# EAGLE design mainboard.v3 (EAGLE 6.4)
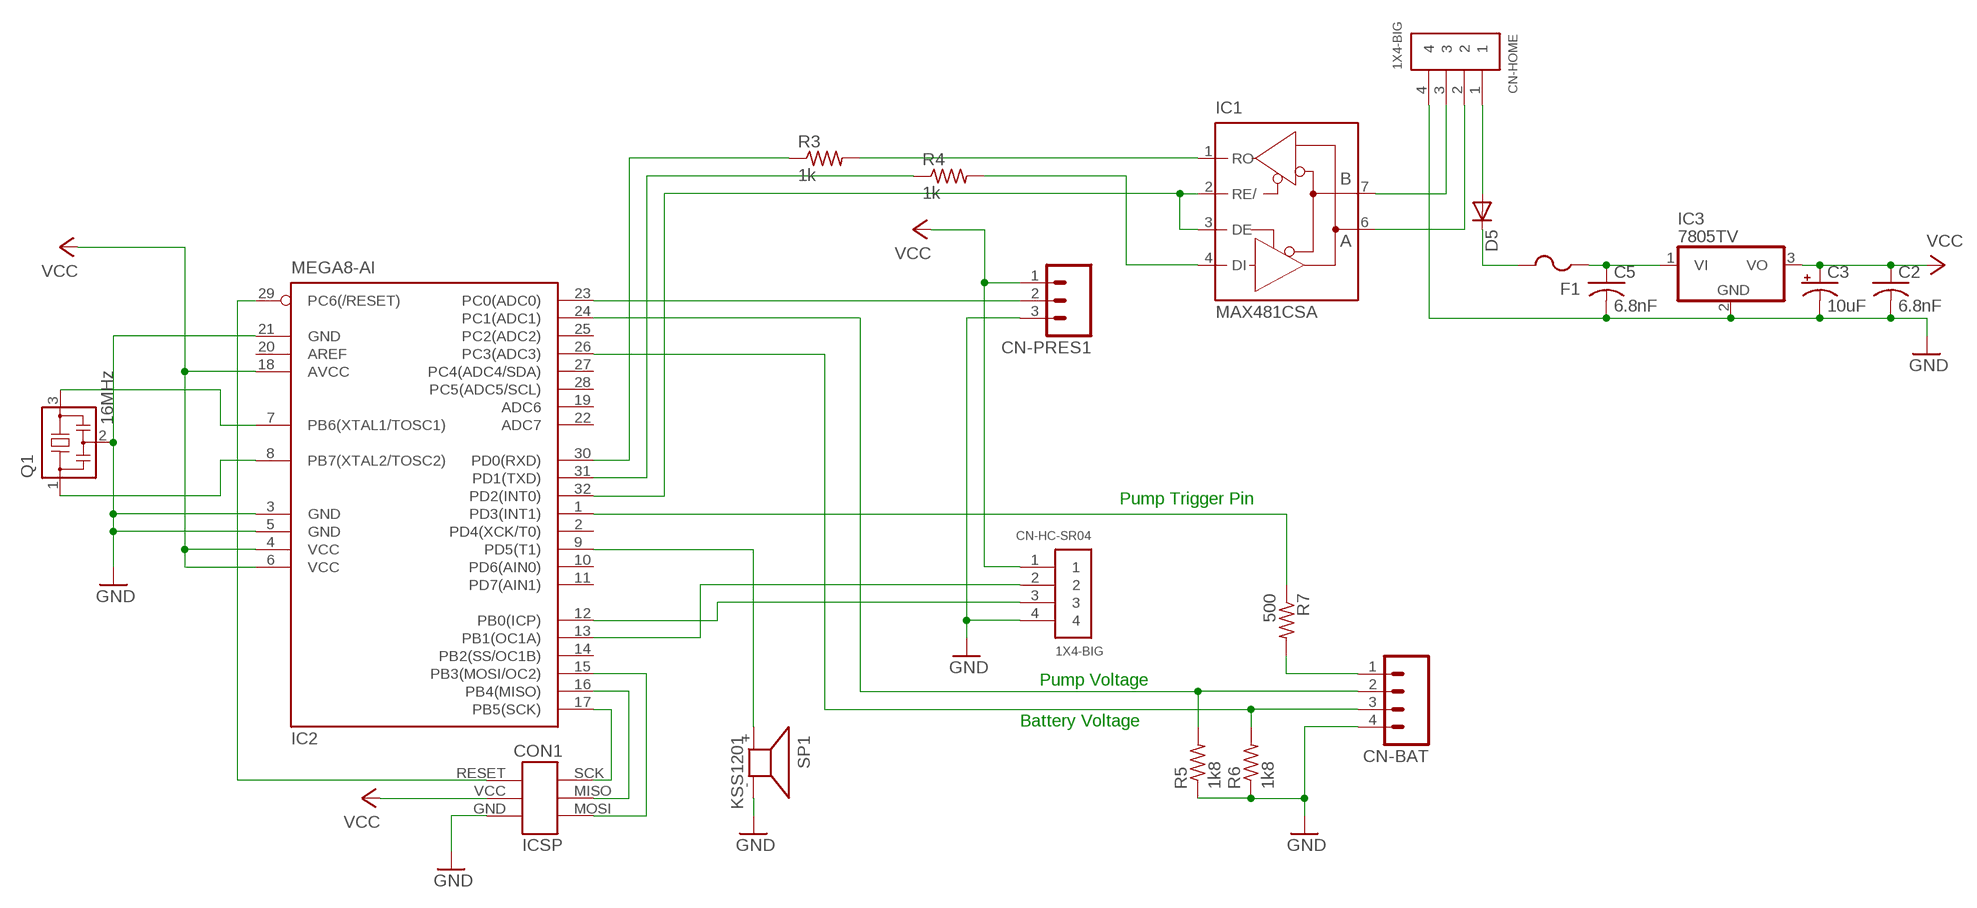
[diagram p0: schematic, sheet 1]

## Parts
C2  6.8nF  C-US050-024X044  [C050-024X044]
C3  10uF  CPOL-USE1.8-4  [E1,8-4]
C5  6.8nF  C-US050-024X044  [C050-024X044]
CN-BAT  M04  [04P]
CN-HC-SR04  1X4-BIG  [1X04-BIG]
CN-HOME  1X4-BIG  [1X04-BIG]
CN-PRES1  M03  [03P]
CON1  ICSP-HEADER  [ICSP-HEADER]
D5  DIODE-MICROMELF-W  [MICROMELF-W]
F1  PTCFUSE-1206  [R1206]
IC1  MAX481CSA  [SO08]
IC2  MEGA8-AI  [TQFP32-08]
IC3  7805TV  [TO220V]
Q1  16MHz  RESONATOR  [RESONATOR]
R3  1k  R-US_R0603  [R0603]
R4  1k  R-US_R0603  [R0603]
R5  1k8  R-US_R0603  [R0603]
R6  1k8  R-US_R0603  [R0603]
R7  500  R-US_R0603  [R0603]
SP1  KSS1201  [KSS1201]

## Nets
GND: C2.2 C3.- C5.2 CN-BAT.4 CN-HC-SR04.4 CN-HOME.4 CN-PRES1.3 CON1.GND IC2.3(GND) IC2.5(GND) IC2.21(GND) IC3.2(GND) Q1.2 R5.1 R6.1 SP1.-
N$1: IC2.7(PB6(XTAL1/TOSC1)) Q1.3
N$2: IC2.8(PB7(XTAL2/TOSC2)) Q1.1
N$3: CON1.SCK IC2.17(PB5(SCK))
N$4: CON1.MISO IC2.16(PB4(MISO))
N$5: CON1.MOSI IC2.15(PB3(MOSI/OC2))
N$6: CON1.RESET IC2.29(PC6(/RESET))
N$8: C5.1 F1.1 IC3.1(VI)
N$9: CN-HOME.1 D5.A
N$10: D5.C F1.2
N$11: IC2.1(PD3(INT1)) R7.1
N$13: IC2.9(PD5(T1)) SP1.+
N$14: IC1.1(RO) R3.2
N$15: IC1.4(DI) R4.2
N$16: CN-BAT.1 R7.2
N$17: CN-PRES1.2 IC2.23(PC0(ADC0))
N$18: CN-HC-SR04.2 IC2.13(PB1(OC1A))
N$19: CN-HC-SR04.3 IC2.12(PB0(ICP))
N$20: CN-HOME.3 IC1.7(B)
N$21: CN-BAT.3 IC2.26(PC3(ADC3)) R6.2
N$22: IC1.2(RE/) IC1.3(DE) IC2.32(PD2(INT0))
N$23: IC2.30(PD0(RXD)) R3.1
N$24: IC2.31(PD1(TXD)) R4.1
N$25: CN-BAT.2 IC2.24(PC1(ADC1)) R5.2
N$26: CN-HOME.2 IC1.6(A)
VCC: C2.1 C3.+ CN-HC-SR04.1 CN-PRES1.1 CON1.VCC(+5V) IC2.4(VCC) IC2.6(VCC) IC2.18(AVCC) IC3.3(VO)
Unconnected: IC2.2(PD4(XCK/T0)) IC2.10(PD6(AIN0)) IC2.11(PD7(AIN1)) IC2.14(PB2(SS/OC1B)) IC2.19(ADC6) IC2.20(AREF) IC2.22(ADC7) IC2.25(PC2(ADC2)) IC2.27(PC4(ADC4/SDA)) IC2.28(PC5(ADC5/SCL))

## Notes on the sheet
- Pump Trigger Pin
- Pump Voltage
- Battery Voltage

## Power pins joined to a net without a drawn wire
GND: IC1.5(GND)
VCC: IC1.8(VCC)

## Library data of the parts
C2 C5 = adafruit:C-US: CAPACITOR, American symbol
C3 = adafruit:CPOL-US: POLARIZED CAPACITOR, American symbol
CN-BAT = con-amp-quick:M04: AMP QUICK CONNECTOR; OC_FARNELL: unknown; OC_NEWARK: unknown
CN-HC-SR04 CN-HOME = adafruit:1X4: 4-pin connector
CN-PRES1 = con-amp-quick:M03: AMP QUICK CONNECTOR; OC_FARNELL: unknown; OC_NEWARK: unknown
CON1 = serge:ICSP-HEADER
D5 = diode:DIODE-: DIODE
F1 = adafruit:PTCFUSE: PTC fuses, resettable thermistors
IC1 = maxim:MAX481CSA: RS485 TRANSEIVER; MF: MAXIM; MPN: MAX481CSA; OC_FARNELL: unknown; OC_NEWARK: 90C3817
IC2 = atmel:MEGA8: MICROCONTROLLER 8 Kbytes FLASH, 1 kbytes SRAM, 512 bytes EEPROM, USART, 6-channel 10 bit ADC, 2-channel 8 bit ADC Pin compatible with Atmega48, ATMega88, ATMega168 Source: avr.lbr; MPN: ATMEGA8-16AU; OC_FARNELL: 9171371; OC_NEWARK: 73M8863
IC3 = linear:78*: Positive VOLTAGE REGULATOR Source: http://cache.national.com/ds/LM/LM78L05.pdf http://www.fairchildsemi.com/ds/LM/LM7805.pdf
Q1 = serge:RESONATOR
R3-R7 = adafruit:R-US_: RESISTOR, American symbol
SP1 = buzzer:KSS1201: SPEAKER Source: Schukat; OC_FARNELL: unknown; OC_NEWARK: unknown

## Board
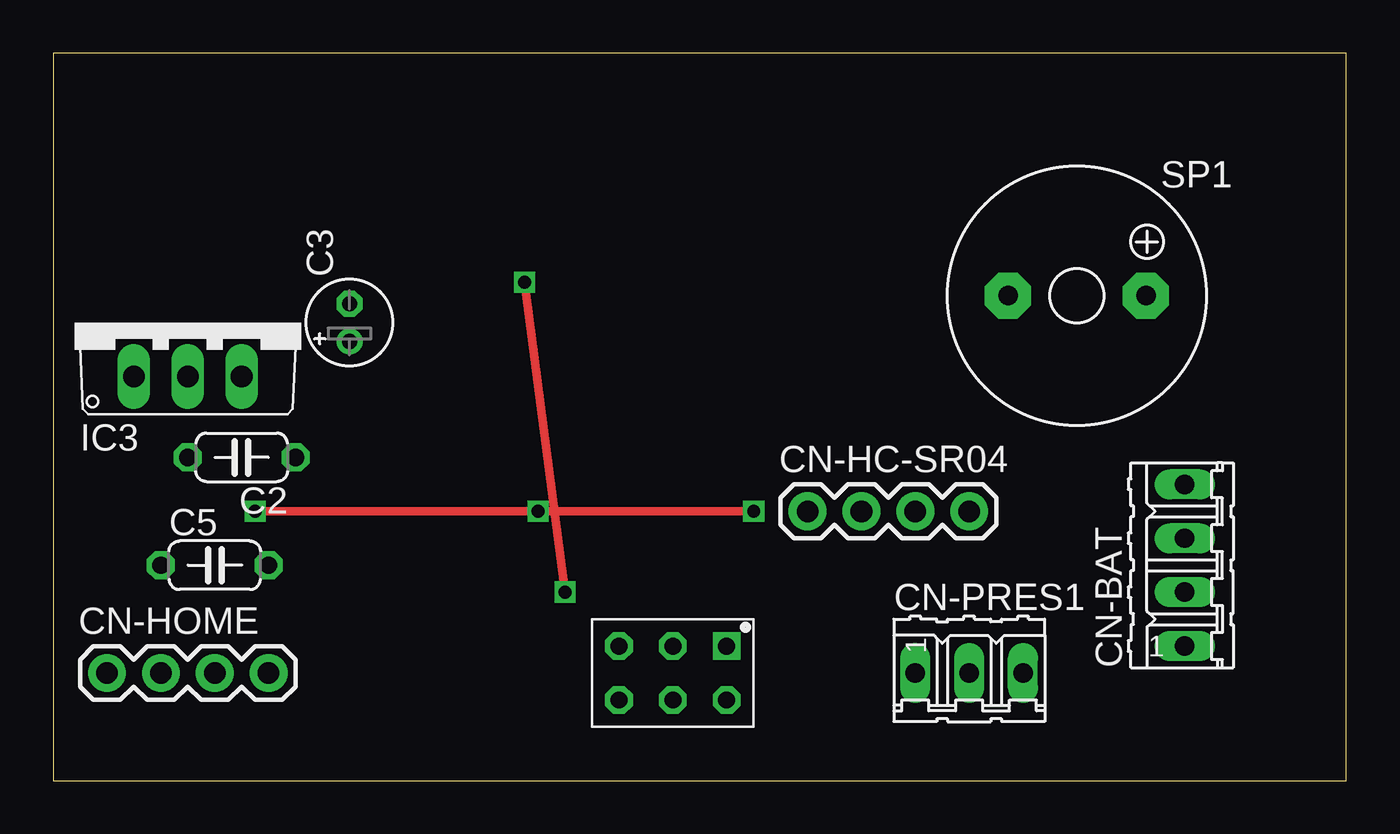
[diagram p1: board, top side]
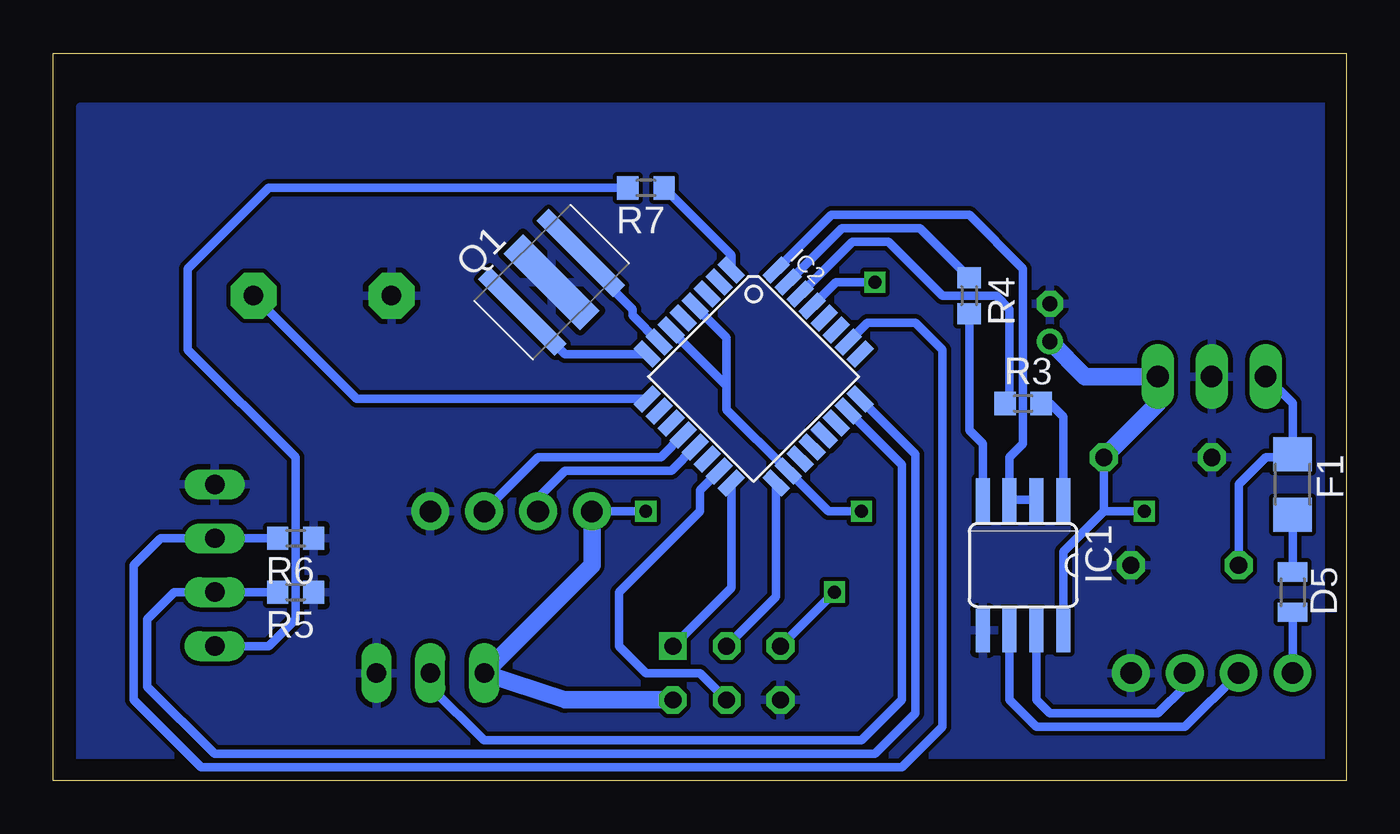
[diagram p2: board, bottom side, seen from below]

Size 60.96 x 34.29 mm. Coordinates in mm from the lower left corner, seen from the top.
Outline: 0,0 60.96,0 60.96,34.29 0,34.29 0,0
Copper layers (1*16): Top 0.035mm / dielectric 1.5mm / Bottom 0.035mm
Design rules "default": minimum track width 10mil, minimum drill 24mil, track to track 8mil, track to pad 8mil, pad to pad 8mil, via to via 8mil, smd to smd 8mil, copper to edge 40mil, drill to drill 8mil, minimum pad ring 10mil, minimum via ring 8mil, stop-mask expansion 4mil, vias tented up to drill 0mil, thermal gap 10mil

### Footprints (pad centres in the part's own frame; a part is rotated, then mirrored left to right if it is on the bottom)
C050-024X044 = drill 0.813 octagon: 1 -2.54,0; 2 2.54,0
E1,8-4 = drill 0.711 pad 1.168: + -0.889,0 | drill 0.711 pad 1.168 octagon: - 0.889,0
04P = drill 0.914 long: 1 -3.81,0; 2 -1.27,0; 3 1.27,0; 4 3.81,0
1X04-BIG = drill 1.016 pad 1.778: 1 0,0; 2 2.54,0; 3 5.08,0; 4 7.62,0
03P = drill 0.914 long: 1 -2.54,0; 2 0,0; 3 2.54,0
ICSP-HEADER = drill 0.8 octagon: GND 1.27,-3.81; MOSI 1.27,-1.27; RESET -1.27,-3.81; SCK -1.27,-1.27; VCC 1.27,1.27 | drill 0.8 square: MISO -1.27,1.27
MICROMELF-W = smd 0.9 x 1.4: A 0.95,0; C -0.95,0
R1206 = smd 1.6 x 1.803: 1 -1.422,0; 2 1.422,0
SO08 = smd 0.66 x 2.032: 1 -1.905,-3.073; 2 -0.635,-3.073; 3 0.635,-3.073; 4 1.905,-3.073; 5 1.905,3.073; 6 0.635,3.073; 7 -0.635,3.073; 8 -1.905,3.073
TQFP32-08 = smd 1.27 x 0.559: 1 -4.293,2.8; 2 -4.293,2; 3 -4.293,1.2; 4 -4.293,0.4; 5 -4.293,-0.4; 6 -4.293,-1.2; 7 -4.293,-2; 8 -4.293,-2.8; 17 4.293,-2.8; 18 4.293,-2; 19 4.293,-1.2; 20 4.293,-0.4; 21 4.293,0.4; 22 4.293,1.2; 23 4.293,2; 24 4.293,2.8 | smd 0.559 x 1.27: 9 -2.8,-4.293; 10 -2,-4.293; 11 -1.2,-4.293; 12 -0.4,-4.293; 13 0.4,-4.293; 14 1.2,-4.293; 15 2,-4.293; 16 2.8,-4.293; 25 2.8,4.293; 26 2,4.293; 27 1.2,4.293; 28 0.4,4.293; 29 -0.4,4.293; 30 -1.2,4.293; 31 -2,4.293; 32 -2.8,4.293
TO220V = drill 1.016 long: 1 -2.54,-2.54; 2 0,-2.54; 3 2.54,-2.54
RESONATOR = smd 0.8 x 5.1: 1 -1.95,0; 3 1.95,0 | smd 1.3 x 5.1: 2 0,0
R0603 = smd 1 x 1.1: 1 -0.85,0; 2 0.85,0
KSS1201 = drill 0.914 pad 2.159 octagon: + 3.251,0; - -3.251,0

### Placement (x,y rotation side)
C2  8.89,15.24 180 top
C3  13.97,21.59 90 top
C5  7.62,10.16 0 top
CN-BAT  53.34,10.16 90 top
CN-HC-SR04  35.56,12.7 0 top
CN-HOME  2.54,5.08 0 top
CN-PRES1  43.18,5.08 0 top
CON1  30.48,5.08 270 top
D5  2.54,8.89 270 bottom
F1  2.54,13.97 270 bottom
IC1  15.24,10.16 180 bottom
IC2  27.94,19.05 315 bottom
IC3  6.35,21.59 0 top
Q1  37.47,23.5 45 bottom
R3  15.24,17.78 0 bottom
R4  17.78,22.86 270 bottom
R5  49.53,8.89 180 bottom
R6  49.53,11.43 180 bottom
R7  33.02,27.94 180 bottom
SP1  48.26,22.86 0 top

### Tracks (layer width: path | path; a pad name or v marks a point on that pad's centre or on a via)
GND
  pour Bottom: 0,0 0,31.75 59.69,31.75 59.69,0
N$1
  Bottom 0.406: IC2.7 33.66,21.94 33.66,22.23 36.09,24.66 Q1.3
N$2
  Bottom 0.406: IC2.8 36.83,20.11 Q1.1
N$3
  Bottom 0.406: CON1.SCK 26.89,8.68 IC2.17
N$4
  Bottom 0.406: CON1.MISO 29,9.11 IC2.16
N$5
  Bottom 0.406: CON1.MOSI 30.48,5.08 33.02,5.08 34.29,6.35 34.29,8.89 30.48,12.7 30.48,13.68 IC2.15
N$6  (via drill 0.6)
  Top 0.406: v24.13,8.89 v22.23,23.5
  Bottom 0.406: CON1.RESET v24.13,8.89 | v22.23,23.5 24.06,23.5 IC2.29
N$8
  Bottom 0.406: IC3.1 2.54,17.78 F1.1 2.69,15.24 3.81,15.24 5.08,13.97 C5.1
N$9
  Bottom 0.406: CN-HOME.1 D5.A
N$10
  Bottom 0.406: D5.C F1.2
N$11
  Bottom 0.406: IC2.1 29,24.77 R7.1
N$13
  Bottom 0.406: IC2.9 46.65,18 SP1.+
N$14
  Bottom 0.406: IC1.1 13.34,17.14 13.97,17.78 R3.2
N$15
  Bottom 0.406: IC1.4 17.14,15.88 17.78,16.51 R4.2
N$16
  Bottom 0.406: R7.2 50.8,27.94 54.61,24.13 54.61,20.32 49.53,15.24 49.53,7.62 50.8,6.35 CN-BAT.1
N$17
  Bottom 0.406: CN-PRES1.2 43.18,4.45 40.64,1.91 22.86,1.91 20.95,3.81 20.95,14.89 IC2.23
N$18
  Bottom 0.406: IC2.13 31.82,14.61 36.83,14.61 38.1,13.34 CN-HC-SR04.2
N$19
  Bottom 0.406: IC2.12 32.32,15.24 38.1,15.24 CN-HC-SR04.3
N$20
  Bottom 0.406: CN-HOME.3 7.62,4.45 8.89,3.17 13.97,3.17 14.61,3.81 IC1.7
N$21
  Bottom 0.406: IC2.26 22.57,21.59 20.32,21.59 19.05,20.32 19.05,2.54 20.95,0.64 53.98,0.64 57.15,3.81 57.15,10.16 55.88,11.43 CN-BAT.3 R6.2
N$22
  Bottom 0.406: IC1.2 IC1.3 15.88,15.24 15.24,15.88 15.24,24.13 17.78,26.67 24.28,26.67 IC2.32
N$23
  Bottom 0.406: IC2.30 23.29,25.4 21.59,25.4 19.05,22.86 16.51,22.86 15.88,22.23 15.88,18 R3.1
N$24
  Bottom 0.406: IC2.31 23.78,26.04 20.11,26.04 R4.1
N$25
  Bottom 0.406: IC2.24 20.32,15.39 20.32,3.17 22.23,1.27 53.34,1.27 56.52,4.45 56.52,7.62 55.24,8.89 CN-BAT.2 R5.2
N$26
  Bottom 0.406: CN-HOME.2 7.62,2.54 14.61,2.54 15.88,3.81 IC1.6
VCC  (via drill 0.6)
  Top 0.406: v9.53,12.7 v22.86,12.7 v33.02,12.7
  Bottom 0.406: IC1.8 13.34,10.79 11.43,12.7 | 11.43,12.7 C2.1 | IC2.4 29.21,20.89 29.21,18.62 | IC2.6 29.21,18.62 | 29.21,18.62 29.21,17.49 IC2.18 24.42,12.7 v22.86,12.7 | v9.53,12.7 11.43,12.7 | CN-HC-SR04.1 v33.02,12.7
  Bottom 0.813: C2.1 8.89,17.78 IC3.3 12.32,19.05 C3.+ | CON1.VCC 36.83,3.81 CN-PRES1.1 35.56,10.16 CN-HC-SR04.1